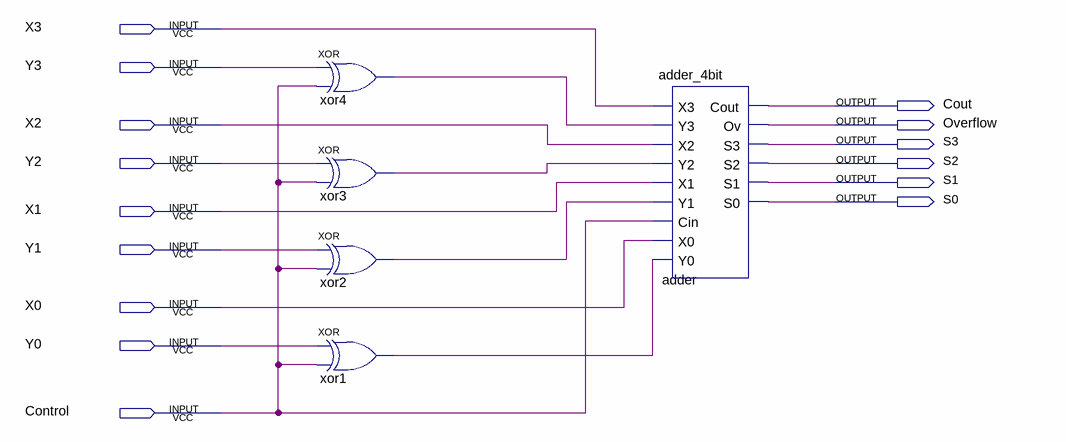
[diagram p0: schematic sheet]
// Quartus schematic add_sub.bdf as structural Verilog: 5 symbols, 15 pins
module add_sub (
  input  X3,
  input  Y3,
  input  X2,
  input  Y2,
  input  X1,
  input  Y1,
  input  X0,
  input  Y0,
  input  Control,
  output Cout,
  output Overflow,
  output S3,
  output S2,
  output S1,
  output S0
);

  wire xor1_out, xor2_out, xor3_out, xor4_out;

  xor xor4 (xor4_out, Y3, Control);
  xor xor3 (xor3_out, Y2, Control);
  xor xor2 (xor2_out, Y1, Control);
  xor xor1 (xor1_out, Y0, Control);
  adder_4bit adder (
    .X3(X3), .Y3(xor4_out), .X2(X2), .Y2(xor3_out), .X1(X1), .Y1(xor2_out), .Cin(Control), .X0(X0),
    .Y0(xor1_out), .Cout(Cout), .Ov(Overflow), .S3(S3), .S2(S2), .S1(S1), .S0(S0));
endmodule
